# Altium schematic sheet 0_architecture.schdoc: Archictecture
size A4; Revision: v0.5; SheetNumber: 1; SheetTotal: 3; Designed by: André M. P. Mattos; Version: v0.1
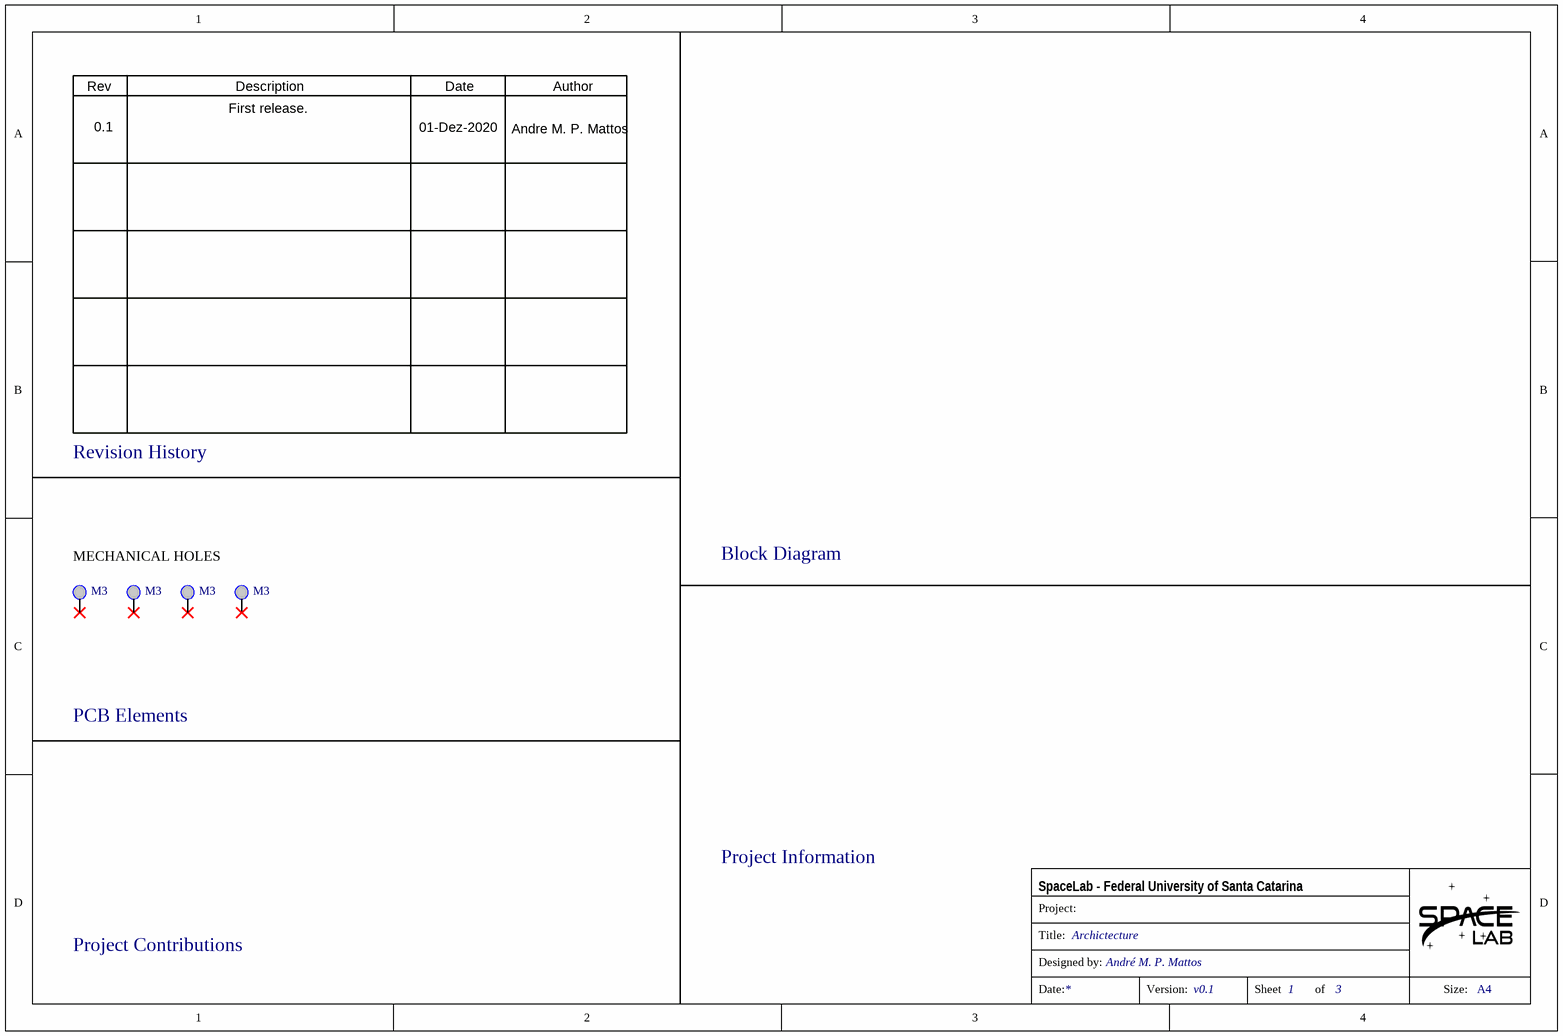
[diagram p0: 0_architecture.schdoc]

## Parts
MEC1  M3  [M3 hole]  (no BOM)
MEC2  M3  [M3 hole]  (no BOM)
MEC3  M3  [M3 hole]  (no BOM)
MEC4  M3  [M3 hole]  (no BOM)

## Nets

Not connected (* = marked no-connect by the designer): MEC1 0*; MEC2 0*; MEC3 0*; MEC4 0*

## Notes on the sheet
- Rev
- Description
- Date
- Author
- 0.1
- First release.
- 01-Dez-2020
- Andre M. P. Mattos
- Revision History
- MECHANICAL HOLES
- Block Diagram
- PCB Elements
- Project Information
- Project Contributions
- Project:
- SpaceLab - Federal University of Santa Catarina
- Title:
- Designed by:
- Date:
- Version:
- Sheet
- of
- Size:
- A4

## Library data of the parts
MEC1-MEC4 = M3 hole